# Altium schematic sheet ESP32.SchDoc
size A4; SheetNumber: 1; SheetTotal: 2
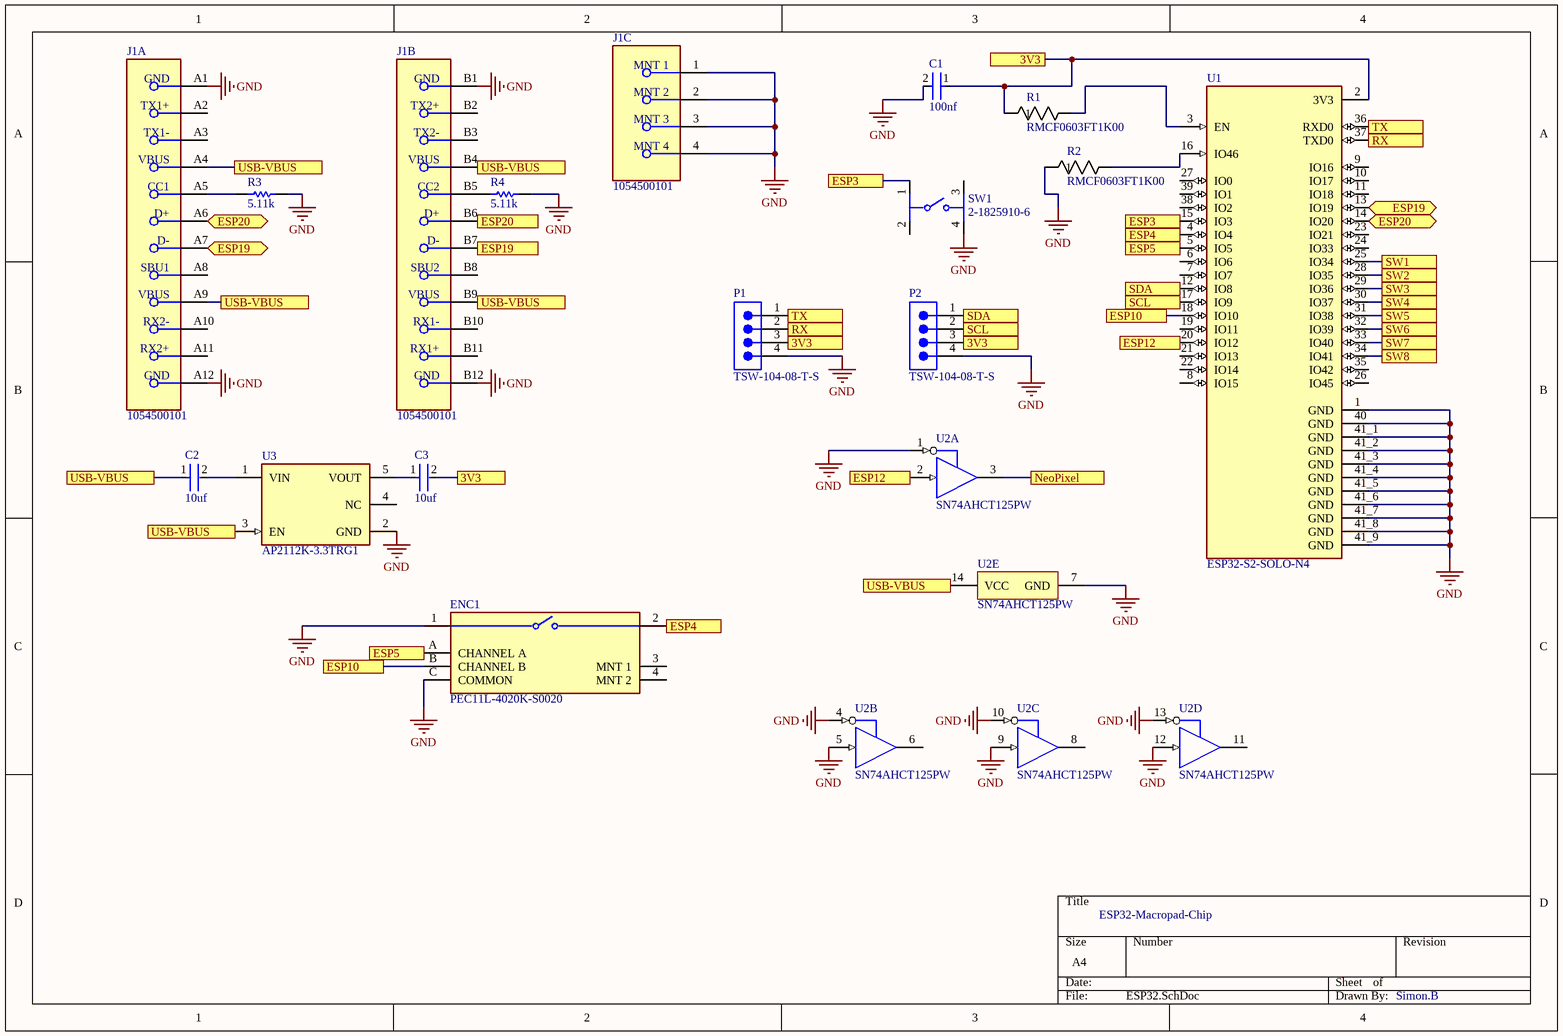
[diagram p0: ESP32.SchDoc]

## Parts
C1  100nf  [FP-CGA3E-0_3-0_1-IPC_B]
C2  10uf  [FP-0603-L_1_6_0_15-W_0_8-IPC_C]
C3  10uf  [FP-0603-L_1_6_0_15-W_0_8-IPC_C]
ENC1  PEC11L-4020K-S0020  [FP-PEC11L-4020K-S0020-MFG]
J1  1054500101  [FP-1054500101-MFG]  (parts A,B,C of 3)
P1  TSW-104-08-T-S  [SMTC-TSW-104-08-X-S]
P2  TSW-104-08-T-S  [SMTC-TSW-104-08-X-S]
R1  RMCF0603FT1K00  [STA_RMCF0603_STP]
R2  RMCF0603FT1K00  [STA_RMCF0603_STP]
R3  5.11k  [RESC2013X70X40LL20T20]
R4  5.11k  [RESC2013X70X40LL20T20]
SW1  2-1825910-6  [FP-2-1825910-6-MFG]
U1  ESP32-S2-SOLO-N4  [XCVR_ESP32-S2-SOLO-N4]
U2  SN74AHCT125PW  [PW0014A_L]  (parts A,B,C,D,E of 5)
U3  AP2112K-3.3TRG1  [FP-SOT25-IPC_A]

## Ports
3V3, ESP3, ESP4, ESP5, ESP10, ESP12, ESP19, ESP19 (bidir), ESP20, ESP20 (bidir), NeoPixel, RX, SCL, SDA, SW1, SW2, SW3, SW4, SW5, SW6, SW7, SW8, TX, USB-VBUS

## Nets
GND: C1.2 ENC1.1 ENC1.C(COMMON) J1.1(MNT_1) J1.2(MNT_2) J1.3(MNT_3) J1.4(MNT_4) J1.A1(GND) J1.A12(GND) J1.B1(GND) J1.B12(GND) P1.4 P2.4 R2.1 R3.2 R4.2 SW1.4 U1.1(GND) U1.40(GND) U1.41_1(GND) U1.41_2(GND) U1.41_3(GND) U1.41_4(GND) U1.41_5(GND) U1.41_6(GND) U1.41_7(GND) U1.41_8(GND) U1.41_9(GND) U2.1(1~{OE}) U2.4(2~{OE}) U2.5(2A) U2.7(GND) U2.9(3A) U2.10(3~{OE}) U2.12(4A) U2.13(4~{OE}) U3.2(GND)
3V3: C1.1 C3.2 P1.3 P2.3 R1.1 U1.2(3V3) ; port 3V3
ESP3: SW1.1 U1.15(IO3) ; port ESP3
ESP4: ENC1.2 U1.4(IO4) ; port ESP4
ESP5: ENC1.A(CHANNEL_A) U1.5(IO5) ; port ESP5
ESP10: ENC1.B(CHANNEL_B) U1.18(IO10) ; port ESP10
ESP12: U1.20(IO12) U2.2(1A) ; port ESP12
ESP19: J1.A7(D-) J1.B7(D-) U1.13(IO19) ; port ESP19
ESP20: J1.A6(D+) J1.B6(D+) U1.14(IO20) ; port ESP20
NeoPixel: U2.3(1Y) ; port NeoPixel
RX: P1.2 U1.37(TXD0) ; port RX
SCL: P2.2 U1.17(IO9) ; port SCL
SDA: P2.1 U1.12(IO8) ; port SDA
SW1: U1.25(IO34) ; port SW1
SW2: U1.28(IO35) ; port SW2
SW3: U1.29(IO36) ; port SW3
SW4: U1.30(IO37) ; port SW4
SW5: U1.31(IO38) ; port SW5
SW6: U1.32(IO39) ; port SW6
SW7: U1.33(IO40) ; port SW7
SW8: U1.34(IO41) ; port SW8
TX: P1.1 U1.36(RXD0) ; port TX
USB-VBUS: C2.1 J1.A4(VBUS) J1.A9(VBUS) J1.B4(VBUS) J1.B9(VBUS) U2.14(VCC) U3.3(EN) ; port USB-VBUS
NetC2_2: C2.2 U3.1(VIN)
NetC3_1: C3.1 U3.5(VOUT)
NetJ1_A5: J1.A5(CC1) R3.1
NetJ1_B5: J1.B5(CC2) R4.1
NetR1_2: R1.2 U1.3(EN)
NetR2_2: R2.2 U1.16(IO46)

Not connected (* = marked no-connect by the designer): ENC1 3(MNT_1) 4(MNT_2); J1 A2(TX1+) A3(TX1-) A8(SBU1) A10(RX2-) A11(RX2+) B2(TX2+) B3(TX2-) B8(SBU2) B10(RX1-) B11(RX1+); SW1 2 3; U1 6(IO6) 7(IO7) 8(IO15) 9(IO16) 10(IO17) 11(IO18) 19(IO11) 21(IO13) 22(IO14) 23(IO21) 24(IO33) 26(IO45) 27(IO0) 35(IO42) 38(IO2) 39(IO1); U2 6(2Y) 8(3Y) 11(4Y); U3 4(NC)

## Notes on the sheet
- ESP32-Macropad-Chip
- Simon.B

## Library data of the parts
C1 = CMP-08246-001006-1: Cap Ceramic 100nF 25V X8R 20% Pad SMD 0603 +150°C Automotive T/R; Package Quantity: 4000; Voltage Rating: 25V; Ratings: AEC-Q200; Mount: Surface Mount; Case/Package: 0603; Features: High Temperature; Case Code (Metric): 1608; Height: 0.8mm; Case Code (Imperial): 0603; Min Operating Temperature: -55°C; Packaging: Tape and Reel; Thickness: 0.035inch; Dielectric: X8R; Tolerance: 20%; Width: 0.031inch; Length: 0.063inch; Capacitance: 100nF; Max Operating Temperature: 150°C; Weight: 7.1E-05oz; Voltage Rating (DC): 25V
C2 C3 = CMP-14477-000293-2: AMK107ABJ106MAHT; Voltage Rating (DC): 4V; Dielectric: X5R; Tolerance: 20%; Lead/Base Style: Bayonet; Case/Package: 0603; Capacitance: 10uF; Case Code (Metric): 1608; Halogen Free: Halogen Free; Max Operating Temperature: 85°C; Case Code (Imperial): 0603; Packaging: Tape and Reel; Ratings: AEC-Q200; Package Quantity: 4000; Mount: Surface Mount; Min Operating Temperature: -55°C; Lead Free: Lead Free; RoHS Compliant: Yes; Width: 0.031inch; Termination: SMD/SMT; Thickness: 0.035inch; Voltage Rating: 4V; Length: 0.063inch; Height: 0.8mm
ENC1 = CMP-07421-000057-1: ROTARY ENCODER; Number of Channels: 2; Output Type: Quadrature; Max Operating Temperature: 80°C; Min Operating Temperature: -25°C; Width: 11.8mm; RoHS Compliant: Yes; Height: 12mm; Package Quantity: 75; Packaging: Bulk; Length: 24.5mm; Termination: Through Hole
J1 = CMP-04767-000004-1: CONN RCP USB3.1 TYPEC 24P SMD RA; Manufacturer: Molex; Number Of Contacts: 24; Voltage Rating: 30V; Shielding: true; Is Female: yes; Current Rating: 0.25/1.25/5A; Pitch: 0.5mm; Conn Orientation: Right Angle; Package: 0; Height: 3.44mm; Footprint Url: https://www.molex.com/pdm_docs/sd/1054500101_sd.pdf; Device Class L1: Connectors; Category: Conn; Device Class L2: USB Connectors; Digikey Description: CONN RCP USB3.1 TYPEC 24P SMD RA; Contact Material: Gold,Nickel; Mouser Description: USB Shielded I/O Receptacle; Type C; Right Angle; Surface Mount; Gold over Nickel; ComponentLink2Description: Datasheet; Lead Free: Yes; Automotive: No; Temperature Range High: +85°C; RoHS: TRUE; Octopart: https://octopart.com/105450-0101-molex-68082325; ComponentLink2URL: https://www.molex.com/webdocs/datasheets/pdf/en-us/1054500101_IO_CONNECTORS.pdf; Temperature: -30°C to +85°C; Usb Standard: USB 3.1; Temperature Range Low: -30°C; Device Class L3: unset; Manufacturer Part Number: 1054500101
P1 P2 = CMP-1024-00356-1: 0.025" SQ Post Header, Through-hole, Vertical, -55 to 105 degC, 2.54 mm Pitch, 4-Pin, Male, RoHS; Manufacturer: Samtec; Pitch: 2.54 mm; PackageDescription: .025[0.64] SQ. Post Terminal Strip Assembly; ComponentLink2URL: http://www.samtec.com/documents/webfiles/pdf/TSW_TH.PDF; ComponentLink3URL: http://www.samtec.com/documents/webfiles/cpdf/TSW-XXX-XX-XXX-X-XX-XXX-MKT.pdf; PackageVersion: DM, 8/1988; ComponentLink3Description: Package Specification; DatasheetVersion: F-214; Orientation: Vertical; RoHS: True; Mounting Technology: Through-hole; ComponentLink1URL: http://www.samtec.com; PartNumber: TSW-104-08-T-S; ComponentLink1Description: Manufacturer URL; Temperature Range: -55 to 105 degC; ComponentLink2Description: Datasheet; PackageReference: TSW-104-08-X-S
R1 R2 = CMP-009-00182-1: Description; Manufacturer_Name: Stackpole International; Copyright: Copyright (C) 2025 Ultra Librarian. All rights reserved.; Design Item ID: RMCF0603FT1K00; Manufacturer_Part_Number: RMCF0603FT1K00; Source: RMCF0603FT1K00.SchLib
R3 R4 = CMP-2001-00218-1: ERJ-6ENF5111V; Manufacturer: Panasonic; Part Number: ERJ-6ENF5111V
SW1 = CMP-03407-000025-1: SWITCH TACTILE SPST-NO 0.05A 24V; Max Current Rating: 50mA; Actuator Type: Standard; Illumination Type: Non-Illuminated; Actuator Material: Nylon; Throw Configuration: SPST; Actuator Length: 0.37inch; Operating Force: 100gf; Switch Function: Off-Mom; Mechanical Life: 100000Cycles; Actuator Color: Brown; Switch Travel: 0.25mm; Packaging: Loose Piece; Series: FSMJ; RoHS Compliant: Yes; Mount: Through Hole; Lead Free: Lead Free; Length: 5.99mm; Voltage Rating (DC): 24V; Type: Switch; Contact Current Rating: 50mA; Contact Material: Copper Alloy; Max Operating Temperature: 85°C; Min Operating Temperature: -35°C; Termination: PC Pin; ELV: Compliant; Orientation: Straight; Contact Plating: Silver
U1 = CMP-030-000000-1: WiFi 802.11b/g/n Transceiver Module 2.4GHz PCB Trace + IPEX Surface Mount; MF: Espressif Systems; SnapEDA_Link: https://www.snapeda.com/parts/ESP32-S2-SOLO-N4/Espressif+Systems/view-part/?ref=snap; Value: *; Design Item ID: ESP32-S2-SOLO-N4; Source: ESP32-S2-SOLO-N4.SchLib; Pin Count: 49; Package: None; MP: ESP32-S2-SOLO-N4; Component Type: Standard; Check_prices: https://www.snapeda.com/parts/ESP32-S2-SOLO-N4/Espressif+Systems/view-part/?ref=eda
U2 = CMP-0440-01088-3: Quadruple Bus Buffer Gates With 3-State Outputs, PW0014A, TUBE; Manufacturer: Texas Instruments; VCC(Min)(V): 4.5; F @ Nom Voltage(Max)(Mhz): 110; Bits(#): 4; VCC(Max)(V): 5.5; tpd @ Nom Voltage(Max)(ns): 8.5; Input Type: TTL; ICC @ Nom Voltage(Max)(mA): 0.02; Output Type: CMOS; Voltage(Nom)(V): 5; Rating: Catalog; Operating Temperature Range(C): -40 to 125; DatasheetVersion: SCLS264O; Code_JEDEC: MO-153; PackageReference: PW0014A; PackageVersion: http://www.ti.com/lit/ml/mpds360/mpds360.pdf; Generic Part Number: SN74AHCT125
U3 = CMP-12756-000035-1: IC REG LINEAR 3.3V 600MA SOT25; Number of Regulators: 1; Output Type: Fixed; Polarity: Positive; Min Input Voltage: 2.5V; Max Input Voltage: 6V; Accuracy: 1.5%; Quiescent Current: 55uA; Dropout Voltage: 250mV; Min Operating Temperature: -40°C; Length: 3.1mm; Output Current: 600mA; Max Operating Temperature: 85°C; Package Quantity: 1; Output Voltage: 3.3V; Width: 1.7mm; Number of Outputs: 1; Packaging: Tape and Reel; Height: 1.3mm; Lead Free: Lead Free; Max Output Current: 600mA; Case/Package: SOT-23-5; Mount: Surface Mount; Number of Pins: 5